# Altium project Baymax.PrjPCB
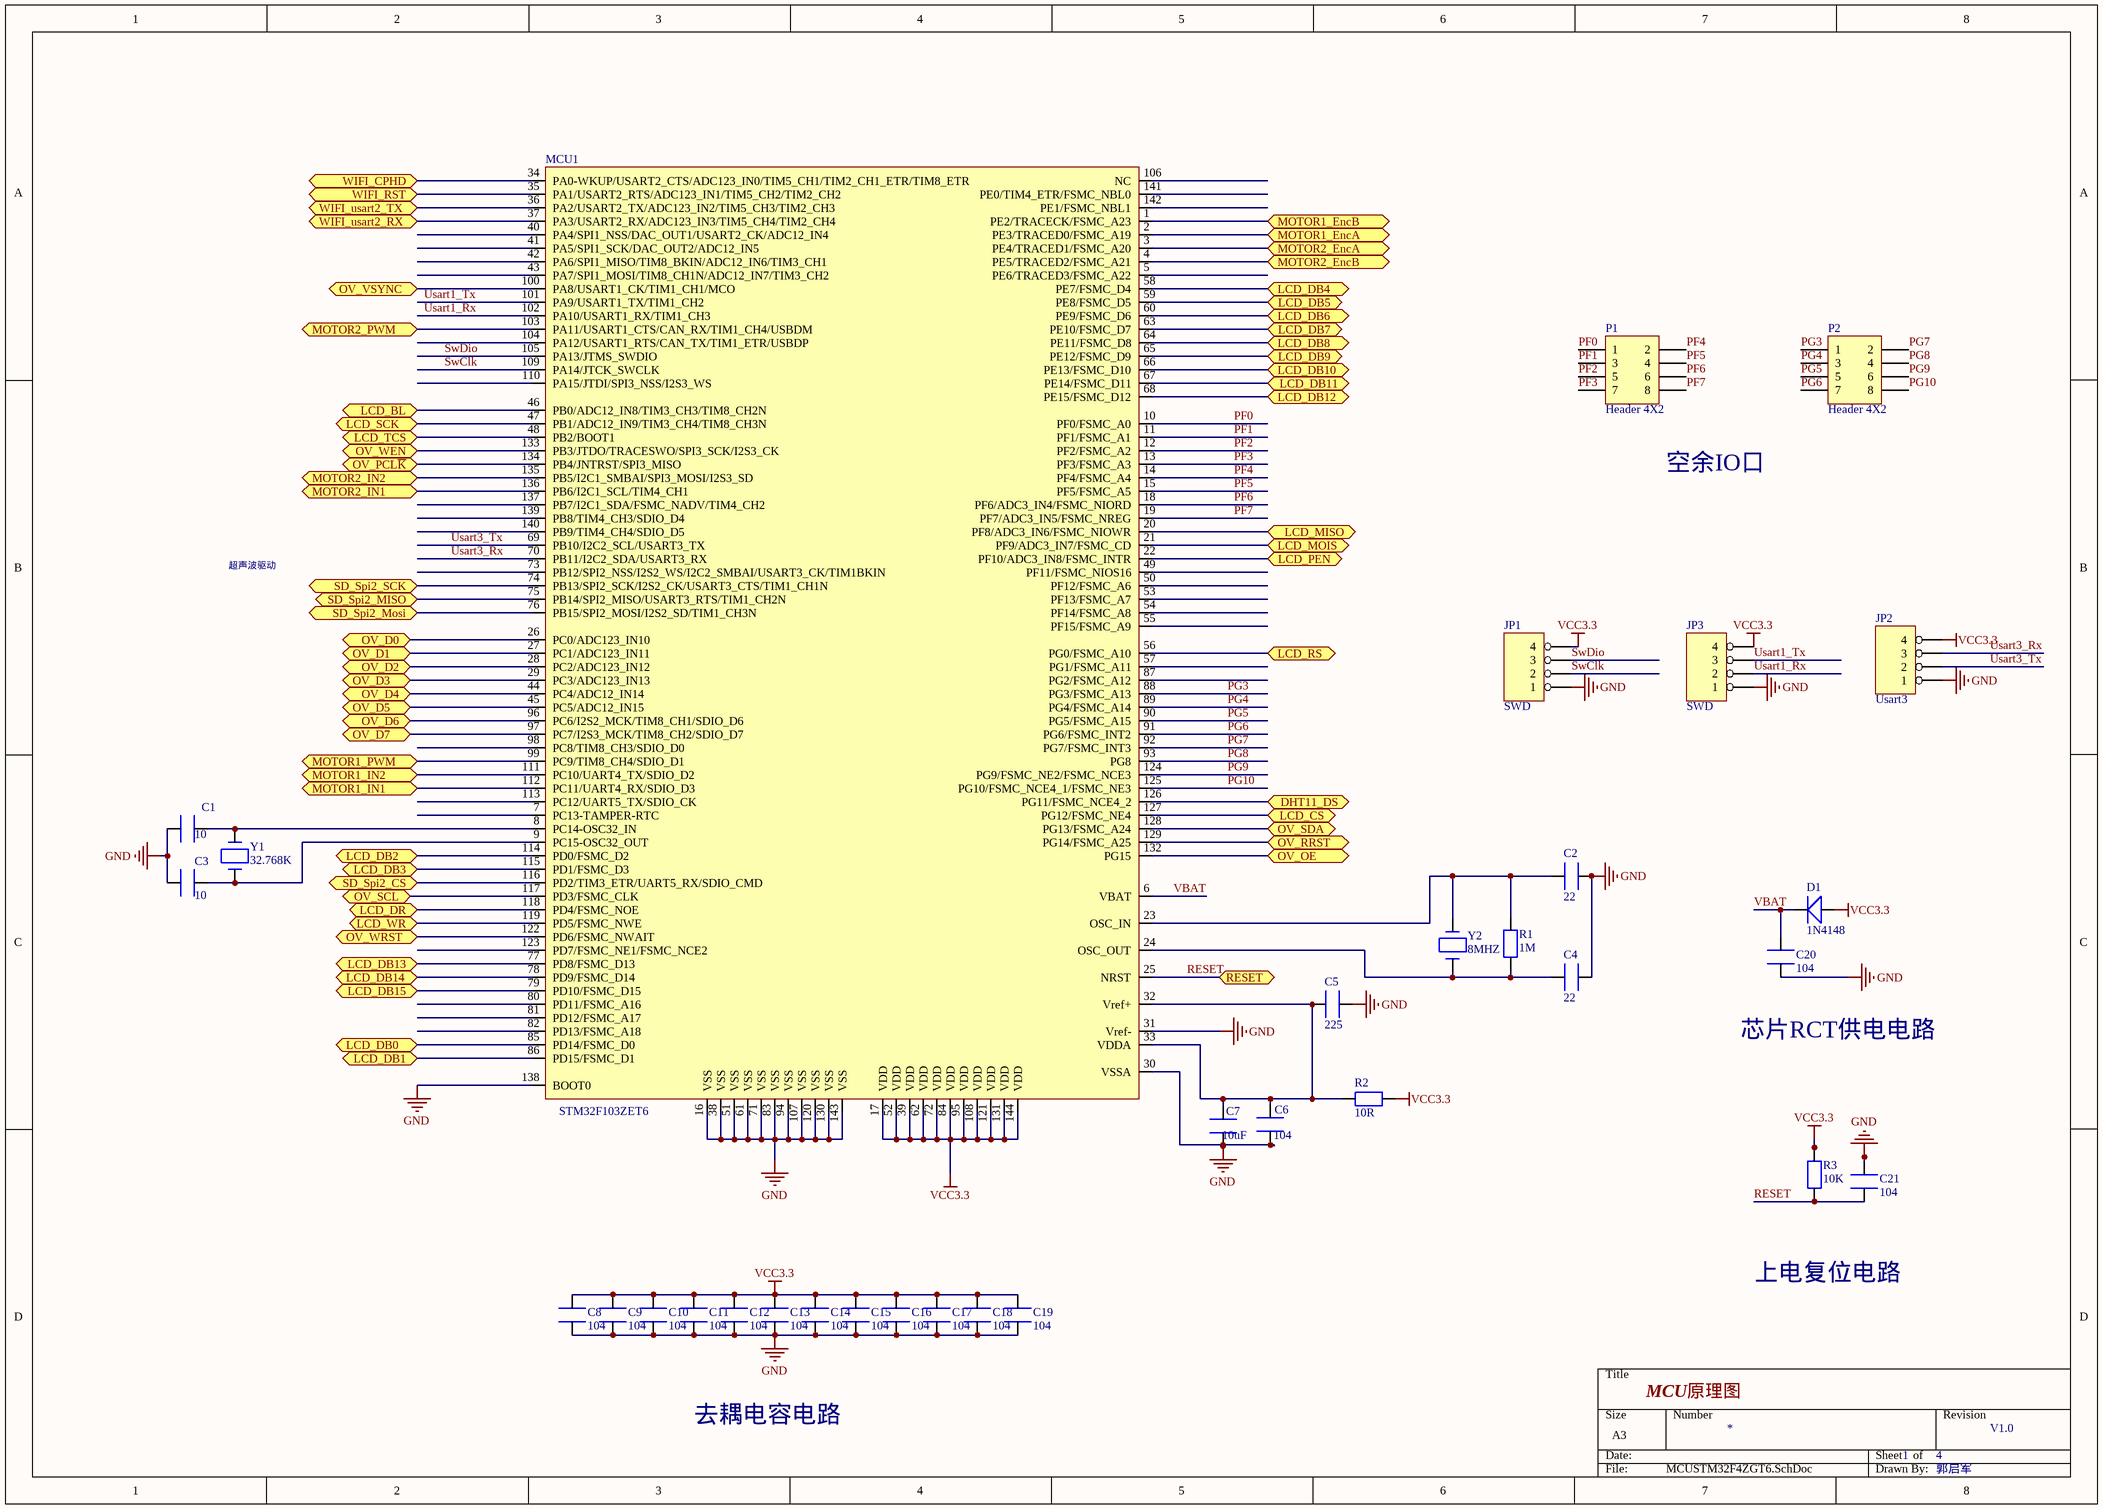
[diagram p0: MCUSTM32F4ZGT6.SchDoc]
4 sheets, 98 parts. Net scope: flat (ports and power ports of the same name join across sheets).
Board file: wificar.PcbDoc
Sheets:
  MCUSTM32F4ZGT6.SchDoc
  BayPower.SchDoc
  MotorDrive.SchDoc
  baymaxother.SchDoc

## Sheet MCUSTM32F4ZGT6.SchDoc
size A3

### Parts
C1  10  [0805-bottom layer]
C2  22  [0805-bottom layer]
C3  10  [0805-bottom layer]
C4  22  [0805-bottom layer]
C5  225  [0805-bottom layer]
C6  104  [0805-bottom layer]
C7  10uF  [0805-bottom layer]
C8  104  [0805-bottom layer]
C9  104  [0805-bottom layer]
C10  104  [0805-bottom layer]
C11  104  [0805-bottom layer]
C12  104  [0805-bottom layer]
C13  104  [0805-bottom layer]
C14  104  [0805-bottom layer]
C15  104  [0805-bottom layer]
C16  104  [0805-bottom layer]
C17  104  [0805-bottom layer]
C18  104  [0805-bottom layer]
C19  104  [0805-bottom layer]
C20  104  [0805-bottom layer]
C21  104  [0805-bottom layer]
D1  1N4148  [DIODE_SOP]
JP1  SWD  [HDR1X4]
JP2  Usart3  [HDR1X4]
JP3  SWD  [HDR1X4]
MCU1  STM32F103ZET6  [LQFP144]
P1  Header 4X2  [HDR2X4]
P2  Header 4X2  [HDR2X4]
R1  1M  [0805-bottom layer]
R2  10R  [0805-bottom layer]
R3  10K  [0805-bottom layer]
Y1  32.768K  [XTAL32]
Y2  8MHZ  [XTAL_US]

### Ports
DHT11_DS, LCD_BL, LCD_CS, LCD_DB0, LCD_DB1, LCD_DB2, LCD_DB3, LCD_DB4, LCD_DB5, LCD_DB6, LCD_DB7, LCD_DB8, LCD_DB9, LCD_DB10, LCD_DB11, LCD_DB12, LCD_DB13, LCD_DB14, LCD_DB15, LCD_DR, LCD_MISO, LCD_MOIS, LCD_PEN, LCD_RS, LCD_SCK, LCD_TCS, LCD_WR, MOTOR1_EncA, MOTOR1_EncB, MOTOR1_IN1, MOTOR1_IN2, MOTOR1_PWM, MOTOR2_EncA, MOTOR2_EncB, MOTOR2_IN1, MOTOR2_IN2, MOTOR2_PWM, OV_D0, OV_D1, OV_D2, OV_D3, OV_D4, OV_D5, OV_D6, OV_D7, OV_OE, OV_PCL~{K}, OV_RRST, OV_SCL, OV_SDA, OV_VSYNC, OV_WEN, OV_WRST, RESET, SD_Spi2_CS, SD_Spi2_MISO, SD_Spi2_Mosi, SD_Spi2_SCK, WIFI_CPHD, WIFI_RST, WIFI_usart2_RX, WIFI_usart2_TX

### Nets
GND: C1.2 C2.1 C3.1 C4.1 C5.1 C6.2 C7.2 C8.2 C9.2 C10.2 C11.2 C12.2 C13.2 C14.2 C15.2 C16.2 C17.2 C18.2 C19.2 C20.1 C21.1 JP1.1 JP2.1 JP3.1 MCU1.16(VSS) MCU1.30(VSSA) MCU1.31(Vref-) MCU1.38(VSS) MCU1.51(VSS) MCU1.61(VSS) MCU1.71(VSS) MCU1.83(VSS) MCU1.94(VSS) MCU1.107(VSS) MCU1.120(VSS) MCU1.130(VSS) MCU1.138(BOOT0) MCU1.143(VSS)
VCC3.3: C8.1 C9.1 C10.1 C11.1 C12.1 C13.1 C14.1 C15.1 C16.1 C17.1 C18.1 C19.1 D1.1 JP1.4 JP2.4 JP3.4 MCU1.17(VDD) MCU1.39(VDD) MCU1.52(VDD) MCU1.62(VDD) MCU1.72(VDD) MCU1.84(VDD) MCU1.95(VDD) MCU1.108(VDD) MCU1.121(VDD) MCU1.131(VDD) MCU1.144(VDD) R2.2 R3.2
PF0: MCU1.10(PF0/FSMC_A0) P1.1
PF1: MCU1.11(PF1/FSMC_A1) P1.3
PF2: MCU1.12(PF2/FSMC_A2) P1.5
PF3: MCU1.13(PF3/FSMC_A3) P1.7
PF4: MCU1.14(PF4/FSMC_A4) P1.2
PF5: MCU1.15(PF5/FSMC_A5) P1.4
PF6: MCU1.18(PF6/ADC3_IN4/FSMC_NIORD) P1.6
PF7: MCU1.19(PF7/ADC3_IN5/FSMC_NREG) P1.8
PG3: MCU1.88(PG3/FSMC_A13) P2.1
PG4: MCU1.89(PG4/FSMC_A14) P2.3
PG5: MCU1.90(PG5/FSMC_A15) P2.5
PG6: MCU1.91(PG6/FSMC_INT2) P2.7
PG7: MCU1.92(PG7/FSMC_INT3) P2.2
PG8: MCU1.93(PG8) P2.4
PG9: MCU1.124(PG9/FSMC_NE2/FSMC_NCE3) P2.6
PG10: MCU1.125(PG10/FSMC_NCE4_1/FSMC_NE3) P2.8
RESET: C21.2 MCU1.25(NRST) R3.1 ; port RESET
SwClk: JP1.2 MCU1.109(PA14/JTCK_SWCLK)
SwDio: JP1.3 MCU1.105(PA13/JTMS_SWDIO)
Usart1_Rx: JP3.2 MCU1.102(PA10/USART1_RX/TIM1_CH3)
Usart1_Tx: JP3.3 MCU1.101(PA9/USART1_TX/TIM1_CH2)
Usart3_Rx: JP2.3 MCU1.70(PB11/I2C2_SDA/USART3_RX)
Usart3_Tx: JP2.2 MCU1.69(PB10/I2C2_SCL/USART3_TX)
VBAT: C20.2 D1.2 MCU1.6(VBAT)
Net*1_5: MCU1.112(PC11/UART4_RX/SDIO_D3) ; port MOTOR1_IN1
Net*1_6: MCU1.99(PC9/TIM8_CH4/SDIO_D1) ; port MOTOR1_PWM
Net*1_7: MCU1.111(PC10/UART4_TX/SDIO_D2) ; port MOTOR1_IN2
Net*1_10: MCU1.135(PB5/I2C1_SMBAI/SPI3_MOSI/I2S3_SD) ; port MOTOR2_IN2
Net*1_11: MCU1.103(PA11/USART1_CTS/CAN_RX/TIM1_CH4/USBDM) ; port MOTOR2_PWM
Net*1_12: MCU1.136(PB6/I2C1_SCL/TIM4_CH1) ; port MOTOR2_IN1
NetC1_1: C1.1 MCU1.8(PC14-OSC32_IN) Y1.2
NetC2_2: C2.2 MCU1.23(OSC_IN) R1.2 Y2.1
NetC3_2: C3.2 MCU1.9(PC15-OSC32_OUT) Y1.1
NetC4_2: C4.2 MCU1.24(OSC_OUT) R1.1 Y2.2
NetC5_2: C5.2 C6.1 C7.1 MCU1.32(Vref+) MCU1.33(VDDA) R2.1
NetLCD1_1: MCU1.127(PG12/FSMC_NE4) ; port LCD_CS
NetLCD1_2: MCU1.56(PG0/FSMC_A10) ; port LCD_RS
NetLCD1_3: MCU1.119(PD5/FSMC_NWE) ; port LCD_WR
NetLCD1_4: MCU1.118(PD4/FSMC_NOE) ; port LCD_DR
NetLCD1_6: MCU1.85(PD14/FSMC_D0) ; port LCD_DB0
NetLCD1_7: MCU1.86(PD15/FSMC_D1) ; port LCD_DB1
NetLCD1_8: MCU1.114(PD0/FSMC_D2) ; port LCD_DB2
NetLCD1_9: MCU1.115(PD1/FSMC_D3) ; port LCD_DB3
NetLCD1_10: MCU1.58(PE7/FSMC_D4) ; port LCD_DB4
NetLCD1_11: MCU1.59(PE8/FSMC_D5) ; port LCD_DB5
NetLCD1_12: MCU1.60(PE9/FSMC_D6) ; port LCD_DB6
NetLCD1_13: MCU1.63(PE10/FSMC_D7) ; port LCD_DB7
NetLCD1_14: MCU1.64(PE11/FSMC_D8) ; port LCD_DB8
NetLCD1_15: MCU1.65(PE12/FSMC_D9) ; port LCD_DB9
NetLCD1_16: MCU1.66(PE13/FSMC_D10) ; port LCD_DB10
NetLCD1_17: MCU1.67(PE14/FSMC_D11) ; port LCD_DB11
NetLCD1_18: MCU1.68(PE15/FSMC_D12) ; port LCD_DB12
NetLCD1_19: MCU1.77(PD8/FSMC_D13) ; port LCD_DB13
NetLCD1_20: MCU1.78(PD9/FSMC_D14) ; port LCD_DB14
NetLCD1_21: MCU1.79(PD10/FSMC_D15) ; port LCD_DB15
NetLCD1_23: MCU1.46(PB0/ADC12_IN8/TIM3_CH3/TIM8_CH2N) ; port LCD_BL
NetLCD1_29: MCU1.20(PF8/ADC3_IN6/FSMC_NIOWR) ; port LCD_MISO
NetLCD1_30: MCU1.21(PF9/ADC3_IN7/FSMC_CD) ; port LCD_MOIS
NetLCD1_31: MCU1.22(PF10/ADC3_IN8/FSMC_INTR) ; port LCD_PEN
NetLCD1_33: MCU1.48(PB2/BOOT1) ; port LCD_TCS
NetLCD1_34: MCU1.47(PB1/ADC12_IN9/TIM3_CH4/TIM8_CH3N) ; port LCD_SCK
NetMCU1_1: MCU1.1(PE2/TRACECK/FSMC_A23) ; port MOTOR1_EncB
NetMCU1_2: MCU1.2(PE3/TRACED0/FSMC_A19) ; port MOTOR1_EncA
NetMCU1_3: MCU1.3(PE4/TRACED1/FSMC_A20) ; port MOTOR2_EncA
NetMCU1_4: MCU1.4(PE5/TRACED2/FSMC_A21) ; port MOTOR2_EncB
NetMCU1_26: MCU1.26(PC0/ADC123_IN10) ; port OV_D0
NetMCU1_27: MCU1.27(PC1/ADC123_IN11) ; port OV_D1
NetMCU1_28: MCU1.28(PC2/ADC123_IN12) ; port OV_D2
NetMCU1_29: MCU1.29(PC3/ADC123_IN13) ; port OV_D3
NetMCU1_34: MCU1.34(PA0-WKUP/USART2_CTS/ADC123_IN0/TIM5_CH1/TIM2_CH1_ETR/TIM8_ETR) ; port WIFI_CPHD
NetMCU1_35: MCU1.35(PA1/USART2_RTS/ADC123_IN1/TIM5_CH2/TIM2_CH2) ; port WIFI_RST
NetMCU1_36: MCU1.36(PA2/USART2_TX/ADC123_IN2/TIM5_CH3/TIM2_CH3) ; port WIFI_usart2_TX
NetMCU1_37: MCU1.37(PA3/USART2_RX/ADC123_IN3/TIM5_CH4/TIM2_CH4) ; port WIFI_usart2_RX
NetMCU1_44: MCU1.44(PC4/ADC12_IN14) ; port OV_D4
NetMCU1_45: MCU1.45(PC5/ADC12_IN15) ; port OV_D5
NetMCU1_74: MCU1.74(PB13/SPI2_SCK/I2S2_CK/USART3_CTS/TIM1_CH1N) ; port SD_Spi2_SCK
NetMCU1_75: MCU1.75(PB14/SPI2_MISO/USART3_RTS/TIM1_CH2N) ; port SD_Spi2_MISO
NetMCU1_76: MCU1.76(PB15/SPI2_MOSI/I2S2_SD/TIM1_CH3N) ; port SD_Spi2_Mosi
NetMCU1_96: MCU1.96(PC6/I2S2_MCK/TIM8_CH1/SDIO_D6) ; port OV_D6
NetMCU1_97: MCU1.97(PC7/I2S3_MCK/TIM8_CH2/SDIO_D7) ; port OV_D7
NetMCU1_100: MCU1.100(PA8/USART1_CK/TIM1_CH1/MCO) ; port OV_VSYNC
NetMCU1_116: MCU1.116(PD2/TIM3_ETR/UART5_RX/SDIO_CMD) ; port SD_Spi2_CS
NetMCU1_117: MCU1.117(PD3/FSMC_CLK) ; port OV_SCL
NetMCU1_122: MCU1.122(PD6/FSMC_NWAIT) ; port OV_WRST
NetMCU1_126: MCU1.126(PG11/FSMC_NCE4_2) ; port DHT11_DS
NetMCU1_128: MCU1.128(PG13/FSMC_A24) ; port OV_SDA
NetMCU1_129: MCU1.129(PG14/FSMC_A25) ; port OV_RRST
NetMCU1_132: MCU1.132(PG15) ; port OV_OE
NetMCU1_133: MCU1.133(PB3/JTDO/TRACESWO/SPI3_SCK/I2S3_CK) ; port OV_WEN
NetMCU1_134: MCU1.134(PB4/JNTRST/SPI3_MISO) ; port OV_PCL~{K}

Not connected (* = marked no-connect by the designer): MCU1 5(PE6/TRACED3/FSMC_A22) 7(PC13-TAMPER-RTC) 40(PA4/SPI1_NSS/DAC_OUT1/USART2_CK/ADC12_IN4) 41(PA5/SPI1_SCK/DAC_OUT2/ADC12_IN5) 42(PA6/SPI1_MISO/TIM8_BKIN/ADC12_IN6/TIM3_CH1) 43(PA7/SPI1_MOSI/TIM8_CH1N/ADC12_IN7/TIM3_CH2) 49(PF11/FSMC_NIOS16) 50(PF12/FSMC_A6) 53(PF13/FSMC_A7) 54(PF14/FSMC_A8) 55(PF15/FSMC_A9) 57(PG1/FSMC_A11) 73(PB12/SPI2_NSS/I2S2_WS/I2C2_SMBAI/USART3_CK/TIM1BKIN) 80(PD11/FSMC_A16) 81(PD12/FSMC_A17) 82(PD13/FSMC_A18) 87(PG2/FSMC_A12) 98(PC8/TIM8_CH3/SDIO_D0) 104(PA12/USART1_RTS/CAN_TX/TIM1_ETR/USBDP) 106(NC) 110(PA15/JTDI/SPI3_NSS/I2S3_WS) 113(PC12/UART5_TX/SDIO_CK) 123(PD7/FSMC_NE1/FSMC_NCE2) 137(PB7/I2C1_SDA/FSMC_NADV/TIM4_CH2) 139(PB8/TIM4_CH3/SDIO_D4) 140(PB9/TIM4_CH4/SDIO_D5) 141(PE0/TIM4_ETR/FSMC_NBL0) 142(PE1/FSMC_NBL1)

### Notes on the sheet
- 空余IO口
- 超声波驱动
- 芯片RCT供电电路
- 上电复位电路
- MCU原理图
- 去耦电容电路
- *
- 1
- 4
- V1.0
- 郭启军

### Library data of the parts
C1 C3 = 10: 电容
C2 C4 = 22: 电容
C5 = 225: 电容
C6 C8-C21 = 104: 电容
C7 = 10uF: 电容
D1 = 1N4148: 限流二极管
JP1-JP3 = HEADER 4
P1 P2 = Header 4X2: Header, 4-Pin, Dual row; LatestRevisionDate: 17-Jul-2002; LatestRevisionNote: Re-released for DXP Platform.; Publisher: Altium Limited
R1 = 1M: 电阻
R2 = 10R: 电阻
R3 = 10K: 电阻
Y1 = 32.768K: 晶振
Y2 = 8MHZ: 晶振

## Sheet BayPower.SchDoc
size A4
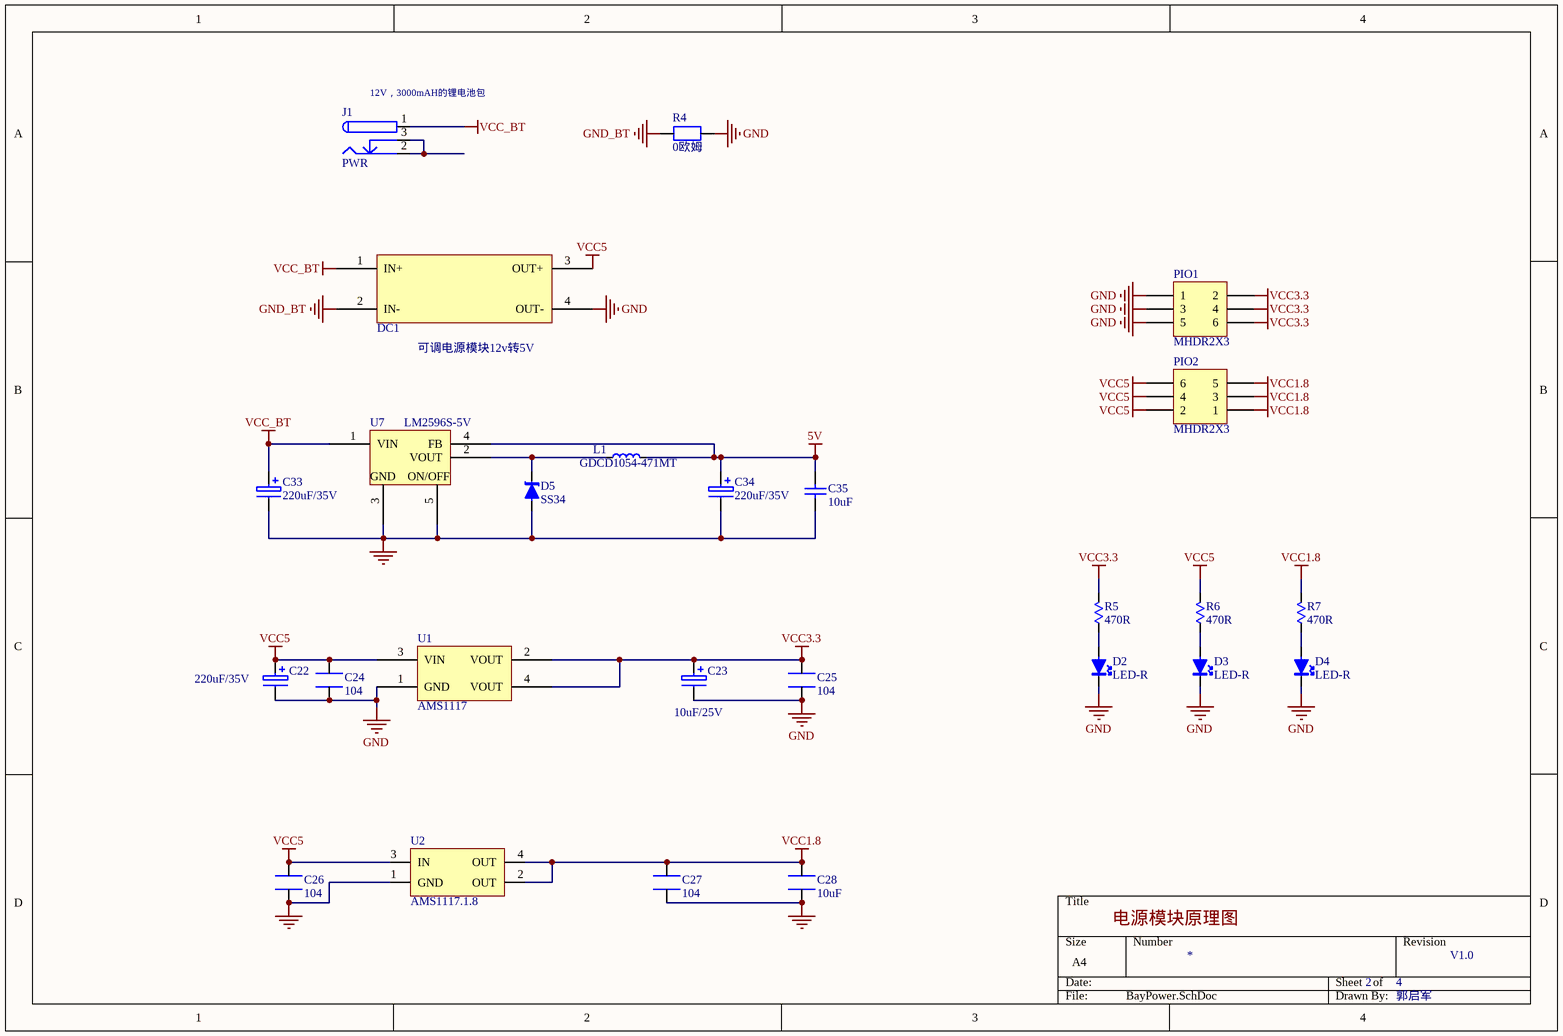
[diagram p1: BayPower.SchDoc]

### Parts
(Parts that share a designator on the sheet are numbered #1, #2 ... from top to bottom, then left to right.)
C22  220uF/35V  [CAPPR-8.3X8.3-SM-F]
C23  10uF/25V  [10UF/25v]
C24  104  [0805-bottom layer]
C25  104  [0805-bottom layer]
C26  104  [0805-bottom layer]
C27  104  [0805-bottom layer]
C28  10uF  [0805-bottom layer]
C33#1  220uF/35V  [CAPPR-8.3X8.3-SM-F]
C34#1  220uF/35V  [CAPPR-8.3X8.3-SM-F]
C35#1  10uF  [C0603-S]
D2  LED-R  [0805-bottom layer]
D3  LED-R  [0805-bottom layer]
D4  LED-R  [0805-bottom layer]
D5#1  SS34  [SMB]
DC1  LM2596S-ADJ  [DC-DC]  (value not drawn)
J1  PWR  [DC10B]
L1  GDCD1054-471MT  [GDCD1054]
PIO1  MHDR2X3  [HDR2X3]
PIO2  MHDR2X3  [HDR2X3]
R4  0欧姆  [0805-bottom layer]
R5  470R  [0805-bottom layer]
R6  470R  [0805-bottom layer]
R7  470R  [0805-bottom layer]
U1  AMS1117  [SOT-223]
U2  AMS1117.1.8  [SOT-223]
U7  LM2596S-5V  [D2PAK]

### Nets
5V: C34#1.1 C35#1.2 L1.2 U7.4(FB)
GND: C22.2 C23.2 C24.2 C25.2 C26.2 C27.2 C28.2 C33#1.2 C34#1.2 C35#1.1 D2.2(K) D3.2(K) D4.2(K) D5#1.1(A) DC1.4(OUT-) PIO1.1 PIO1.3 PIO1.5 R4.2 U1.1(GND) U2.1(GND) U7.3(GND) U7.5(ON/OFF)
GND_BT: DC1.2(IN-) R4.1
VCC1.8: C27.1 C28.1 PIO2.1 PIO2.3 PIO2.5 R7.1 U2.2(OUT) U2.4(OUT)
VCC3.3: C23.1 C25.1 PIO1.2 PIO1.4 PIO1.6 R5.1 U1.2(VOUT) U1.4(VOUT)
VCC5: C22.1 C24.1 C26.1 DC1.3(OUT+) PIO2.2 PIO2.4 PIO2.6 R6.1 U1.3(VIN) U2.3(IN)
VCC_BT: C33#1.1 DC1.1(IN+) J1.1 U7.1(VIN)
NetD2_1: D2.1(A) R5.2
NetD3_1: D3.1(A) R6.2
NetD4_1: D4.1(A) R7.2
NetD5#1_2: D5#1.2(K) L1.1 U7.2(VOUT)
NetJ1_2: J1.2 J1.3

### Notes on the sheet
- (near J1) 12V，3000mAH的锂电池包
- (near DC1) 可调电源模块12v转5V
- 电源模块原理图
- *
- 2
- 4
- V1.0
- 郭启军

### Library data of the parts
C22 C33#1 C34#1 = CAP-ELEC: Polarized Capacitor
C23 = CAP-ELEC_2: Polarized Capacitor
C24-C27 = 104: 电容
C28 = 10uF: 电容
C35#1 = CAP: Capacitor
D2-D4 = LED: Light Emitting Diode
D5#1 = DIODE-SBD: Schottky barrier rectifier
DC1 = LM2596S-ADJ: LM2596S-ADJ DC-DC电源模块
L1 = INDUCT: Inductor
PIO1 PIO2 = MHDR2X3: Header, 3-Pin, Dual row; LatestRevisionDate: 17-Jul-2002; LatestRevisionNote: Re-released for DXP Platform.; Publisher: Altium Limited
R4 = 1M: 电阻
R5-R7 = RES: Resistor
U1 = AMS1117: 800mA Low-Dropout Linear Regulator
U2 = AMS1117.1.8: 电压转换
U7 = LM2596

## Sheet MotorDrive.SchDoc
size A4
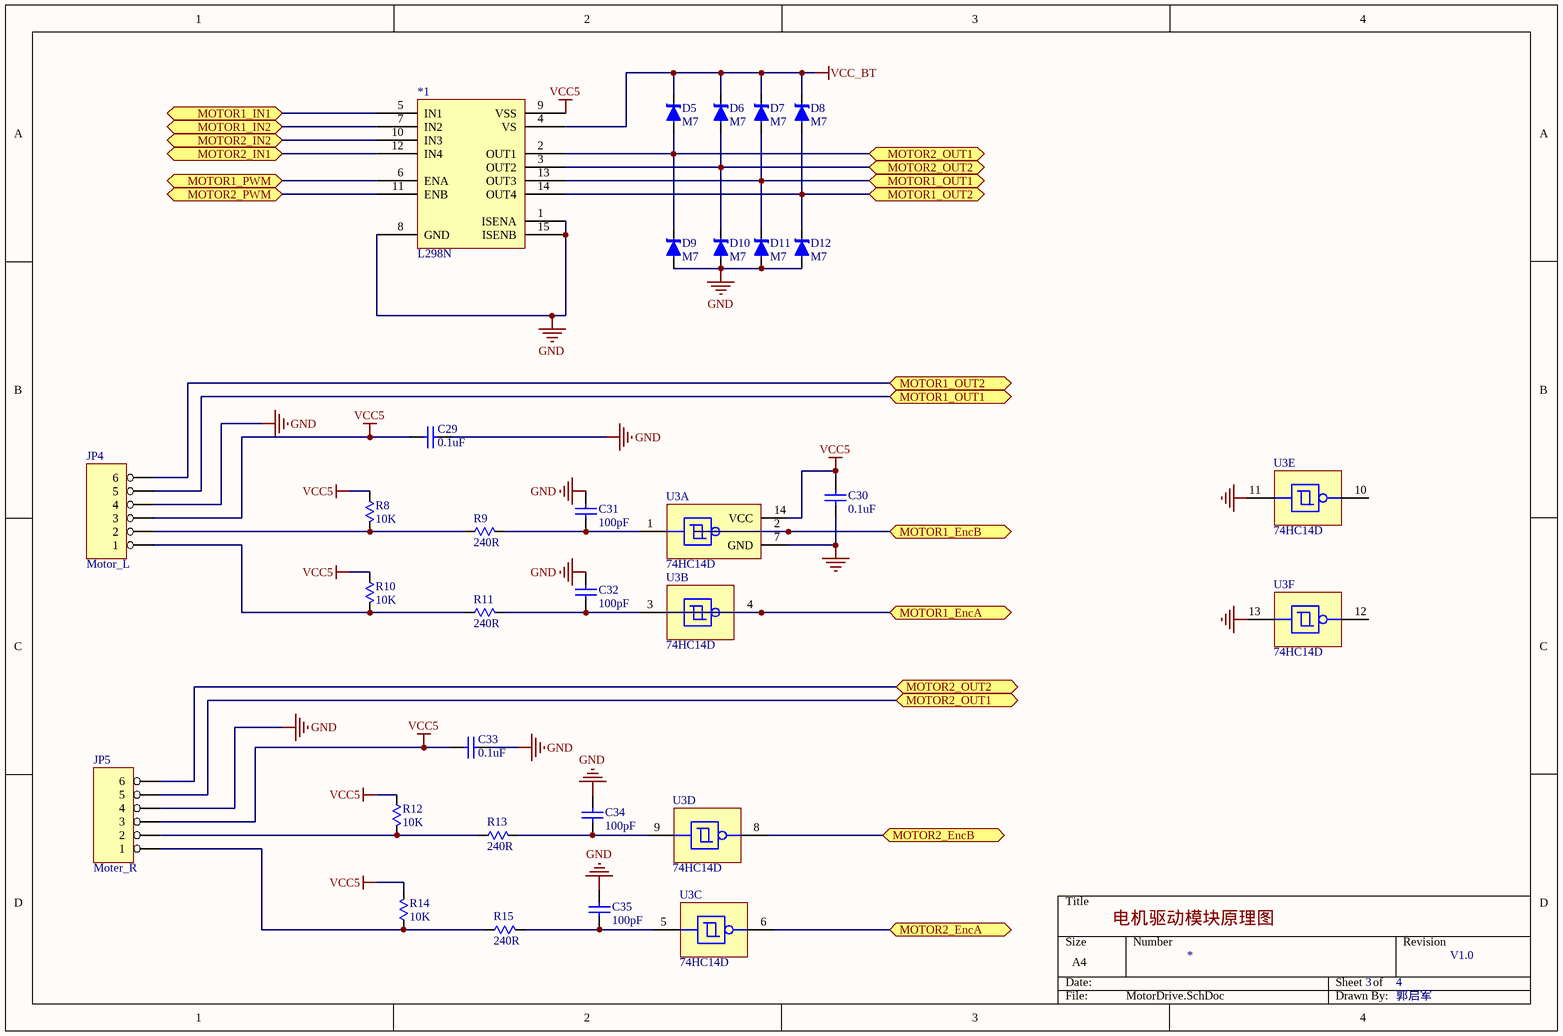
[diagram p2: MotorDrive.SchDoc]

### Parts
(Parts that share a designator on the sheet are numbered #1, #2 ... from top to bottom, then left to right.)
*1  L298N  [L298N散热片]
C29  0.1uF  [0805-bottom layer]
C30  0.1uF  [0805-bottom layer]
C31  100pF  [0805-bottom layer]
C32  100pF  [0805-bottom layer]
C33#2  0.1uF  [0805-bottom layer]
C34#2  100pF  [0805-bottom layer]
C35#2  100pF  [0805-bottom layer]
D5#2  M7  [SMB]
D6  M7  [SMB]
D7  M7  [SMB]
D8  M7  [SMB]
D9  M7  [SMB]
D10  M7  [SMB]
D11  M7  [SMB]
D12  M7  [SMB]
JP4  Motor_L  [HDR1X6]
JP5  Moter_R  [HDR1X6]
R8  10K  [0805-bottom layer]
R9  240R  [0805-bottom layer]
R10  10K  [0805-bottom layer]
R11  240R  [0805-bottom layer]
R12  10K  [0805-bottom layer]
R13  240R  [0805-bottom layer]
R14  10K  [0805-bottom layer]
R15  240R  [0805-bottom layer]
U3  74HC14D  [SO14-150]  (parts A,B,C,D,E,F of 6)

### Ports
MOTOR1_EncA, MOTOR1_EncB, MOTOR1_IN1, MOTOR1_IN2, MOTOR1_OUT1, MOTOR1_OUT2, MOTOR1_PWM, MOTOR2_EncA, MOTOR2_EncB, MOTOR2_IN1, MOTOR2_IN2, MOTOR2_OUT1, MOTOR2_OUT2, MOTOR2_PWM

### Nets
GND: *1.1(ISENA) *1.8(GND) *1.15(ISENB) C29.2 C30.2 C31.1 C32.1 C33#2.2 C34#2.1 C35#2.2 D9.1(A) D10.1(A) D11.1(A) D12.1(A) JP4.4 JP5.4 U3.7(GND) U3.11(A) U3.13(A)
VCC5: *1.9(VSS) C29.1 C30.1 C33#2.1 JP4.3 JP5.3 R8.2 R10.2 R12.2 R14.1 U3.14(VCC)
VCC_BT: *1.4(VS) D5#2.2(K) D6.2(K) D7.2(K) D8.2(K)
Net*1_2: *1.2(OUT1) D5#2.1(A) D9.2(K) JP5.5 ; port MOTOR2_OUT1
Net*1_3: *1.3(OUT2) D6.1(A) D10.2(K) JP5.6 ; port MOTOR2_OUT2
Net*1_5: *1.5(IN1) ; port MOTOR1_IN1
Net*1_6: *1.6(ENA) ; port MOTOR1_PWM
Net*1_7: *1.7(IN2) ; port MOTOR1_IN2
Net*1_10: *1.10(IN3) ; port MOTOR2_IN2
Net*1_11: *1.11(ENB) ; port MOTOR2_PWM
Net*1_12: *1.12(IN4) ; port MOTOR2_IN1
Net*1_13: *1.13(OUT3) D7.1(A) D11.2(K) JP4.5 ; port MOTOR1_OUT1
Net*1_14: *1.14(OUT4) D8.1(A) D12.2(K) JP4.6 ; port MOTOR1_OUT2
NetC31_2: C31.2 R9.1 U3.1(A)
NetC32_2: C32.2 R11.1 U3.3(A)
NetC34#2_2: C34#2.2 R13.1 U3.9(A)
NetC35#2_1: C35#2.1 R15.1 U3.5(A)
NetJP4_1: JP4.1 R10.1 R11.2
NetJP4_2: JP4.2 R8.1 R9.2
NetJP5_1: JP5.1 R14.2 R15.2
NetJP5_2: JP5.2 R12.1 R13.2
NetMCU1_1: U3.2(Y) ; port MOTOR1_EncB
NetMCU1_2: U3.4(Y) ; port MOTOR1_EncA
NetMCU1_3: U3.6(Y) ; port MOTOR2_EncA
NetMCU1_4: U3.8(Y) ; port MOTOR2_EncB

Not connected (* = marked no-connect by the designer): U3 10(Y) 12(Y)

### Notes on the sheet
- 电机驱动模块原理图
- *
- 3
- 4
- V1.0
- 郭启军

### Library data of the parts
C29-C32 C33#2 C34#2 C35#2 = CAP: Capacitor
D5#2 D6-D12 = DIODE-SBD: Schottky barrier rectifier
JP4 JP5 = HEADER 6
R8-R15 = RES: Resistor
U3 = 74HC14D: Hex inverting Schmitt trigger

## Sheet baymaxother.SchDoc
size A4
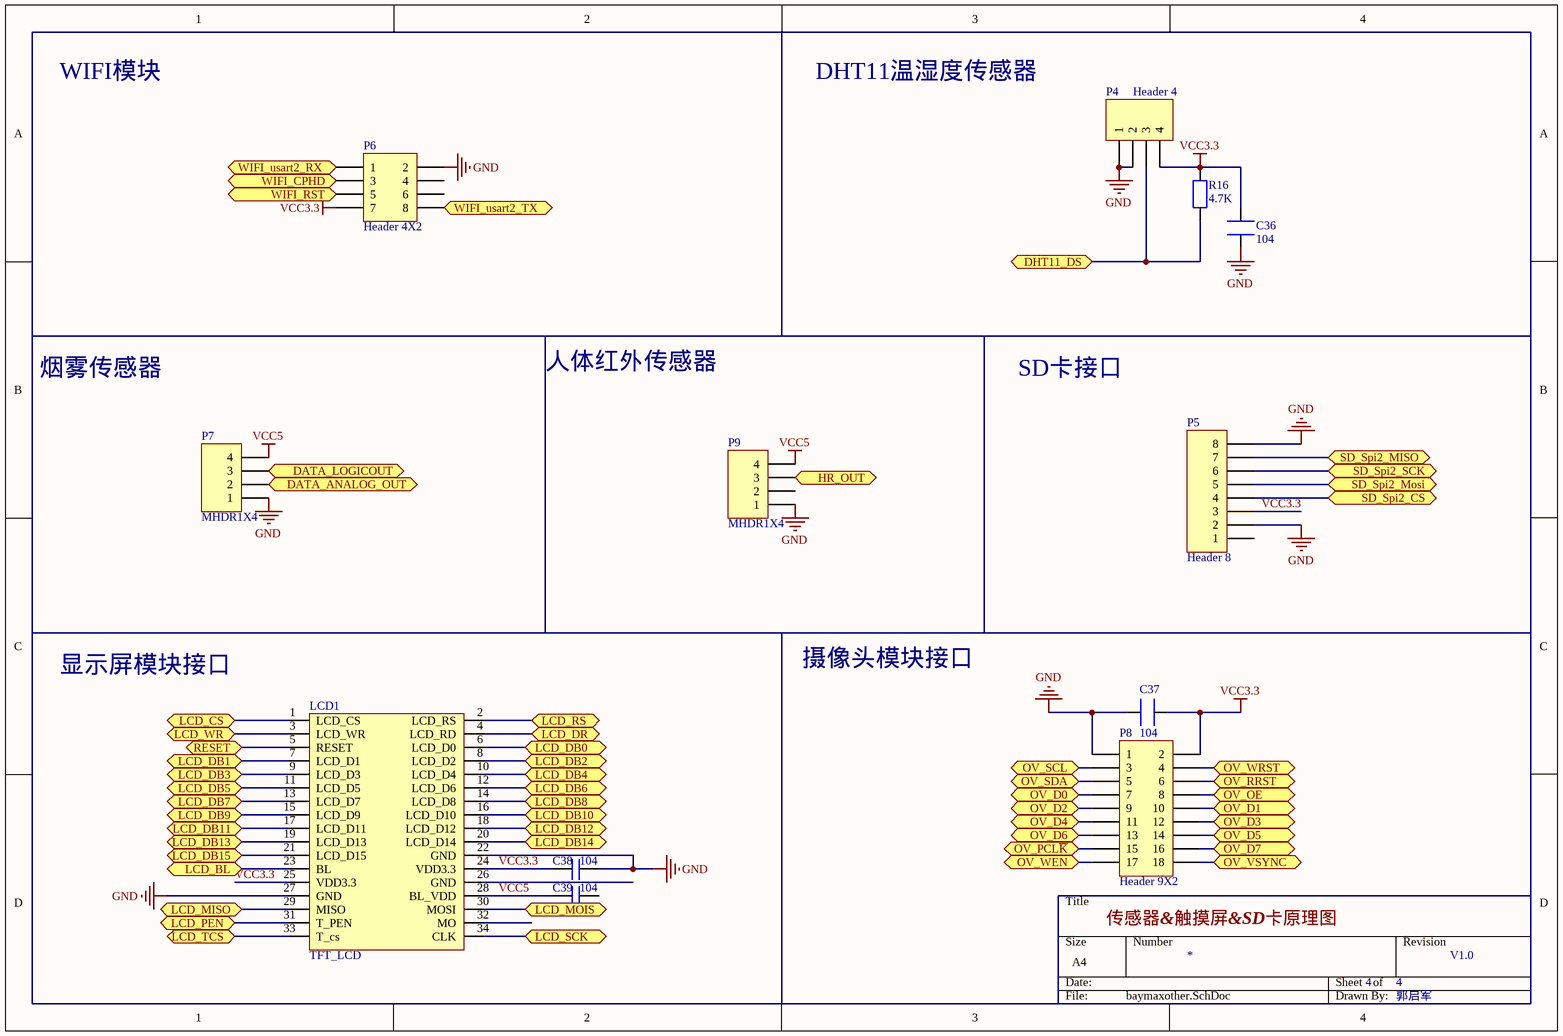
[diagram p3: baymaxother.SchDoc]

### Parts
C36  104  [0805-bottom layer]
C37  104  [0805-bottom layer]
C38  104  [0805-bottom layer]
C39  104  [0805-bottom layer]
LCD1  TFT_LCD  [HDR2X17]
P4  Header 4  [HDR1X4]
P5  Header 8  [HDR1X8]
P6  Header 4X2  [HDR2X4]
P7  MHDR1X4  [MHDR1X4]
P8  Header 9X2  [HDR2X9]
P9  MHDR1X4  [MHDR1X4]
R16  4.7K  [0805-bottom layer]

### Ports
DATA_ANALOG_OUT, DATA_LOGICOUT, DHT11_DS, HR_OUT, LCD_BL, LCD_CS, LCD_DB0, LCD_DB1, LCD_DB2, LCD_DB3, LCD_DB4, LCD_DB5, LCD_DB6, LCD_DB7, LCD_DB8, LCD_DB9, LCD_DB10, LCD_DB11, LCD_DB12, LCD_DB13, LCD_DB14, LCD_DB15, LCD_DR, LCD_MISO, LCD_MOIS, LCD_PEN, LCD_RS, LCD_SCK, LCD_TCS, LCD_WR, OV_D0, OV_D1, OV_D2, OV_D3, OV_D4, OV_D5, OV_D6, OV_D7, OV_OE, OV_PCL~{K}, OV_RRST, OV_SCL, OV_SDA, OV_VSYNC, OV_WEN, OV_WRST, RESET, SD_Spi2_CS, SD_Spi2_MISO, SD_Spi2_Mosi, SD_Spi2_SCK, WIFI_CPHD, WIFI_RST, WIFI_usart2_RX, WIFI_usart2_TX

### Nets
GND: C36.2 C37.2 C38.2 LCD1.22(GND) LCD1.27(GND) P4.1 P4.2 P5.2 P5.8 P6.2 P7.1 P8.1 P9.1
VCC3.3: C36.1 C37.1 C38.1 LCD1.24(VDD3.3) LCD1.25(VDD3.3) P4.4 P5.3 P6.7 P8.2 R16.1
VCC5: C39.1 LCD1.28(BL_VDD) P7.4 P9.4
RESET: LCD1.5(RESET) ; port RESET
NetLCD1_1: LCD1.1(LCD_CS) ; port LCD_CS
NetLCD1_2: LCD1.2(LCD_RS) ; port LCD_RS
NetLCD1_3: LCD1.3(LCD_WR) ; port LCD_WR
NetLCD1_4: LCD1.4(LCD_RD) ; port LCD_DR
NetLCD1_6: LCD1.6(LCD_D0) ; port LCD_DB0
NetLCD1_7: LCD1.7(LCD_D1) ; port LCD_DB1
NetLCD1_8: LCD1.8(LCD_D2) ; port LCD_DB2
NetLCD1_9: LCD1.9(LCD_D3) ; port LCD_DB3
NetLCD1_10: LCD1.10(LCD_D4) ; port LCD_DB4
NetLCD1_11: LCD1.11(LCD_D5) ; port LCD_DB5
NetLCD1_12: LCD1.12(LCD_D6) ; port LCD_DB6
NetLCD1_13: LCD1.13(LCD_D7) ; port LCD_DB7
NetLCD1_14: LCD1.14(LCD_D8) ; port LCD_DB8
NetLCD1_15: LCD1.15(LCD_D9) ; port LCD_DB9
NetLCD1_16: LCD1.16(LCD_D10) ; port LCD_DB10
NetLCD1_17: LCD1.17(LCD_D11) ; port LCD_DB11
NetLCD1_18: LCD1.18(LCD_D12) ; port LCD_DB12
NetLCD1_19: LCD1.19(LCD_D13) ; port LCD_DB13
NetLCD1_20: LCD1.20(LCD_D14) ; port LCD_DB14
NetLCD1_21: LCD1.21(LCD_D15) ; port LCD_DB15
NetLCD1_23: LCD1.23(BL) ; port LCD_BL
NetLCD1_29: LCD1.29(MISO) ; port LCD_MISO
NetLCD1_30: LCD1.30(MOSI) ; port LCD_MOIS
NetLCD1_31: LCD1.31(T_PEN) ; port LCD_PEN
NetLCD1_33: LCD1.33(T_cs) ; port LCD_TCS
NetLCD1_34: LCD1.34(CLK) ; port LCD_SCK
NetMCU1_26: P8.7 ; port OV_D0
NetMCU1_27: P8.10 ; port OV_D1
NetMCU1_28: P8.9 ; port OV_D2
NetMCU1_29: P8.12 ; port OV_D3
NetMCU1_34: P6.3 ; port WIFI_CPHD
NetMCU1_35: P6.5 ; port WIFI_RST
NetMCU1_36: P6.8 ; port WIFI_usart2_TX
NetMCU1_37: P6.1 ; port WIFI_usart2_RX
NetMCU1_44: P8.11 ; port OV_D4
NetMCU1_45: P8.14 ; port OV_D5
NetMCU1_74: P5.6 ; port SD_Spi2_SCK
NetMCU1_75: P5.7 ; port SD_Spi2_MISO
NetMCU1_76: P5.5 ; port SD_Spi2_Mosi
NetMCU1_96: P8.13 ; port OV_D6
NetMCU1_97: P8.16 ; port OV_D7
NetMCU1_100: P8.18 ; port OV_VSYNC
NetMCU1_116: P5.4 ; port SD_Spi2_CS
NetMCU1_117: P8.3 ; port OV_SCL
NetMCU1_122: P8.4 ; port OV_WRST
NetMCU1_126: P4.3 R16.2 ; port DHT11_DS
NetMCU1_128: P8.5 ; port OV_SDA
NetMCU1_129: P8.6 ; port OV_RRST
NetMCU1_132: P8.8 ; port OV_OE
NetMCU1_133: P8.17 ; port OV_WEN
NetMCU1_134: P8.15 ; port OV_PCL~{K}
NetP7_2: P7.2 ; port DATA_ANALOG_OUT
NetP7_3: P7.3 ; port DATA_LOGICOUT
NetP9_3: P9.3 ; port HR_OUT

Not connected (* = marked no-connect by the designer): C39 2; LCD1 26(GND) 32(MO); P5 1; P6 4 6; P9 2

### Notes on the sheet
- WIFI模块
- DHT11温湿度传感器
- 烟雾传感器
- 人体红外传感器
- SD卡接口
- 显示屏模块接口
- 摄像头模块接口
- (near P8) 传感器&触摸屏&SD卡原理图
- *
- 4
- V1.0
- 郭启军

### Library data of the parts
C36 C37 = 104: 电容
C38 C39 = C
P4 = Header 4: Header, 4-Pin; LatestRevisionDate: 17-Jul-2002; LatestRevisionNote: Re-released for DXP Platform.; Publisher: Altium Limited
P5 = Header 8: Header, 8-Pin; LatestRevisionDate: 17-Jul-2002; LatestRevisionNote: Re-released for DXP Platform.; Publisher: Altium Limited
P6 = Header 4X2: Header, 4-Pin, Dual row; LatestRevisionDate: 17-Jul-2002; LatestRevisionNote: Re-released for DXP Platform.; Publisher: Altium Limited
P7 P9 = MHDR1X4: Header, 4-Pin; LatestRevisionDate: 17-Jul-2002; LatestRevisionNote: Re-released for DXP Platform.; Publisher: Altium Limited
P8 = Header 9X2: Header, 9-Pin, Dual row; LatestRevisionDate: 17-Jul-2002; LatestRevisionNote: Re-released for DXP Platform.; Publisher: Altium Limited
R16 = 4.7K: 电阻

## Nets that join several sheets
GND: MCUSTM32F4ZGT6 (38 pins), BayPower (23 pins), MotorDrive (19 pins), baymaxother (13 pins)
VCC3.3: MCUSTM32F4ZGT6 (29 pins), BayPower (8 pins), baymaxother (10 pins)
VCC5: BayPower (10 pins), MotorDrive (11 pins), baymaxother (C39.1 LCD1.28 P7.4 P9.4)
VCC_BT: BayPower (C33#1.1 DC1.1 J1.1 U7.1), MotorDrive (5 pins)
Net*1_5: MCUSTM32F4ZGT6 (MCU1.112), MotorDrive (*1.5)
Net*1_6: MCUSTM32F4ZGT6 (MCU1.99), MotorDrive (*1.6)
Net*1_7: MCUSTM32F4ZGT6 (MCU1.111), MotorDrive (*1.7)
Net*1_10: MCUSTM32F4ZGT6 (MCU1.135), MotorDrive (*1.10)
Net*1_11: MCUSTM32F4ZGT6 (MCU1.103), MotorDrive (*1.11)
Net*1_12: MCUSTM32F4ZGT6 (MCU1.136), MotorDrive (*1.12)
NetLCD1_1: MCUSTM32F4ZGT6 (MCU1.127), baymaxother (LCD1.1)
NetLCD1_2: MCUSTM32F4ZGT6 (MCU1.56), baymaxother (LCD1.2)
NetLCD1_3: MCUSTM32F4ZGT6 (MCU1.119), baymaxother (LCD1.3)
NetLCD1_4: MCUSTM32F4ZGT6 (MCU1.118), baymaxother (LCD1.4)
NetLCD1_6: MCUSTM32F4ZGT6 (MCU1.85), baymaxother (LCD1.6)
NetLCD1_7: MCUSTM32F4ZGT6 (MCU1.86), baymaxother (LCD1.7)
NetLCD1_8: MCUSTM32F4ZGT6 (MCU1.114), baymaxother (LCD1.8)
NetLCD1_9: MCUSTM32F4ZGT6 (MCU1.115), baymaxother (LCD1.9)
NetLCD1_10: MCUSTM32F4ZGT6 (MCU1.58), baymaxother (LCD1.10)
NetLCD1_11: MCUSTM32F4ZGT6 (MCU1.59), baymaxother (LCD1.11)
NetLCD1_12: MCUSTM32F4ZGT6 (MCU1.60), baymaxother (LCD1.12)
NetLCD1_13: MCUSTM32F4ZGT6 (MCU1.63), baymaxother (LCD1.13)
NetLCD1_14: MCUSTM32F4ZGT6 (MCU1.64), baymaxother (LCD1.14)
NetLCD1_15: MCUSTM32F4ZGT6 (MCU1.65), baymaxother (LCD1.15)
NetLCD1_16: MCUSTM32F4ZGT6 (MCU1.66), baymaxother (LCD1.16)
NetLCD1_17: MCUSTM32F4ZGT6 (MCU1.67), baymaxother (LCD1.17)
NetLCD1_18: MCUSTM32F4ZGT6 (MCU1.68), baymaxother (LCD1.18)
NetLCD1_19: MCUSTM32F4ZGT6 (MCU1.77), baymaxother (LCD1.19)
NetLCD1_20: MCUSTM32F4ZGT6 (MCU1.78), baymaxother (LCD1.20)
NetLCD1_21: MCUSTM32F4ZGT6 (MCU1.79), baymaxother (LCD1.21)
NetLCD1_23: MCUSTM32F4ZGT6 (MCU1.46), baymaxother (LCD1.23)
NetLCD1_29: MCUSTM32F4ZGT6 (MCU1.20), baymaxother (LCD1.29)
NetLCD1_30: MCUSTM32F4ZGT6 (MCU1.21), baymaxother (LCD1.30)
NetLCD1_31: MCUSTM32F4ZGT6 (MCU1.22), baymaxother (LCD1.31)
NetLCD1_33: MCUSTM32F4ZGT6 (MCU1.48), baymaxother (LCD1.33)
NetLCD1_34: MCUSTM32F4ZGT6 (MCU1.47), baymaxother (LCD1.34)
NetMCU1_1: MCUSTM32F4ZGT6 (MCU1.1), MotorDrive (U3.2)
NetMCU1_2: MCUSTM32F4ZGT6 (MCU1.2), MotorDrive (U3.4)
NetMCU1_3: MCUSTM32F4ZGT6 (MCU1.3), MotorDrive (U3.6)
NetMCU1_4: MCUSTM32F4ZGT6 (MCU1.4), MotorDrive (U3.8)
NetMCU1_26: MCUSTM32F4ZGT6 (MCU1.26), baymaxother (P8.7)
NetMCU1_27: MCUSTM32F4ZGT6 (MCU1.27), baymaxother (P8.10)
NetMCU1_28: MCUSTM32F4ZGT6 (MCU1.28), baymaxother (P8.9)
NetMCU1_29: MCUSTM32F4ZGT6 (MCU1.29), baymaxother (P8.12)
NetMCU1_34: MCUSTM32F4ZGT6 (MCU1.34), baymaxother (P6.3)
NetMCU1_35: MCUSTM32F4ZGT6 (MCU1.35), baymaxother (P6.5)
NetMCU1_36: MCUSTM32F4ZGT6 (MCU1.36), baymaxother (P6.8)
NetMCU1_37: MCUSTM32F4ZGT6 (MCU1.37), baymaxother (P6.1)
NetMCU1_44: MCUSTM32F4ZGT6 (MCU1.44), baymaxother (P8.11)
NetMCU1_45: MCUSTM32F4ZGT6 (MCU1.45), baymaxother (P8.14)
NetMCU1_74: MCUSTM32F4ZGT6 (MCU1.74), baymaxother (P5.6)
NetMCU1_75: MCUSTM32F4ZGT6 (MCU1.75), baymaxother (P5.7)
NetMCU1_76: MCUSTM32F4ZGT6 (MCU1.76), baymaxother (P5.5)
NetMCU1_96: MCUSTM32F4ZGT6 (MCU1.96), baymaxother (P8.13)
NetMCU1_97: MCUSTM32F4ZGT6 (MCU1.97), baymaxother (P8.16)
NetMCU1_100: MCUSTM32F4ZGT6 (MCU1.100), baymaxother (P8.18)
NetMCU1_116: MCUSTM32F4ZGT6 (MCU1.116), baymaxother (P5.4)
NetMCU1_117: MCUSTM32F4ZGT6 (MCU1.117), baymaxother (P8.3)
NetMCU1_122: MCUSTM32F4ZGT6 (MCU1.122), baymaxother (P8.4)
NetMCU1_126: MCUSTM32F4ZGT6 (MCU1.126), baymaxother (P4.3 R16.2)
NetMCU1_128: MCUSTM32F4ZGT6 (MCU1.128), baymaxother (P8.5)
NetMCU1_129: MCUSTM32F4ZGT6 (MCU1.129), baymaxother (P8.6)
NetMCU1_132: MCUSTM32F4ZGT6 (MCU1.132), baymaxother (P8.8)
NetMCU1_133: MCUSTM32F4ZGT6 (MCU1.133), baymaxother (P8.17)
NetMCU1_134: MCUSTM32F4ZGT6 (MCU1.134), baymaxother (P8.15)
RESET: MCUSTM32F4ZGT6 (C21.2 MCU1.25 R3.1), baymaxother (LCD1.5)